# EAGLE schematic Voltage Regulation (EAGLE 7.6.0)
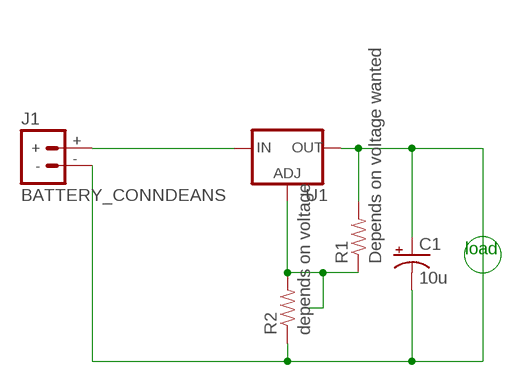
[diagram p0: schematic, sheet 1]

## Parts
C1  10u  CAP_POLPTH2  [CPOL-RADIAL-10UF-25V]
J1  BATTERY_CONNDEANS  [DEANS]
R1  Depends on voltage wanted  RESISTORPTH-1/2W  [AXIAL-0.5]
R2  depends on voltage  RESISTORPTH-1/2W  [AXIAL-0.5]
U1  V_REG_317DPACK  [V-REG_DPACK]

## Nets
N$1: J1.+ U1.3(IN)
N$2: C1.1(+) C1.2(-) J1.- R1.P$2 R2.P$1 U1.4(OUT)
N$4: R1.P$1 R2.P$2 U1.1(ADJ)

## Notes on the sheet
- load

## Library data of the parts
C1 = SparkFun-Capacitors:CAP_POL: Capacitor Polarized These are standard SMD and PTH capacitors. Normally 10uF, 47uF, and 100uF in electrolytic and tantalum varieties. Always verify the external diameter of the through hole cap, it varies with capacity, voltage, and manufacturer. The EIA devices should be standard.
J1 = SparkFun-Connectors:BATTERY_CONN: Various footprints for battery connectors
R1 R2 = SparkFun-Resistors:RESISTOR: Resistor Basic schematic elements and footprints for 0603, 1206, and PTH resistors.
U1 = SparkFun-PowerIC:V_REG_317: Voltage Regulator Standard LM317 adjustable voltage regulator. AOI (Adjust Output Input). Google 'LM317 Calculator' for easy to use app to get the two resistor values needed. 240/720 for 5V output. 240/390 for 3.3V output. Spark Fun Electronics SKU : COM-00527; PROD_ID: IC-09888